# Altium schematic sheet Модуль соединений.SchDoc: Модуль соединений
size 209 x 297 mm; ApprovedBy: Кузьмич; CheckedBy: Папковский; DrawnBy: Стречень; Organization: НИЧ БГУИР; DocumentNumber: ГЛЮИ.145678.001 Э3; SheetNumber: 1; PageSetup: Record=PageOptions|CenterHorizontal=True|CenterVertical=True|PrintScale=1.00|XCorrection=1.00|YCorrection=1.00|PrintKind=2|BorderSize=5000000|LeftOffset=0|BottomOffset=0|Orientation=2|PaperLength=1000|PaperWidth=1000|Scale=100|PaperSource=7|PrintQuality=-4|MediaType=1|DitherType=10|PrintScaleMode=1|PaperKind=A4; ProcessInspection: Радевич; DocumentType: Схема электрическая принципиальная; ImagePath: ГЛЮИ.145678.001; ProjectName: Модуль
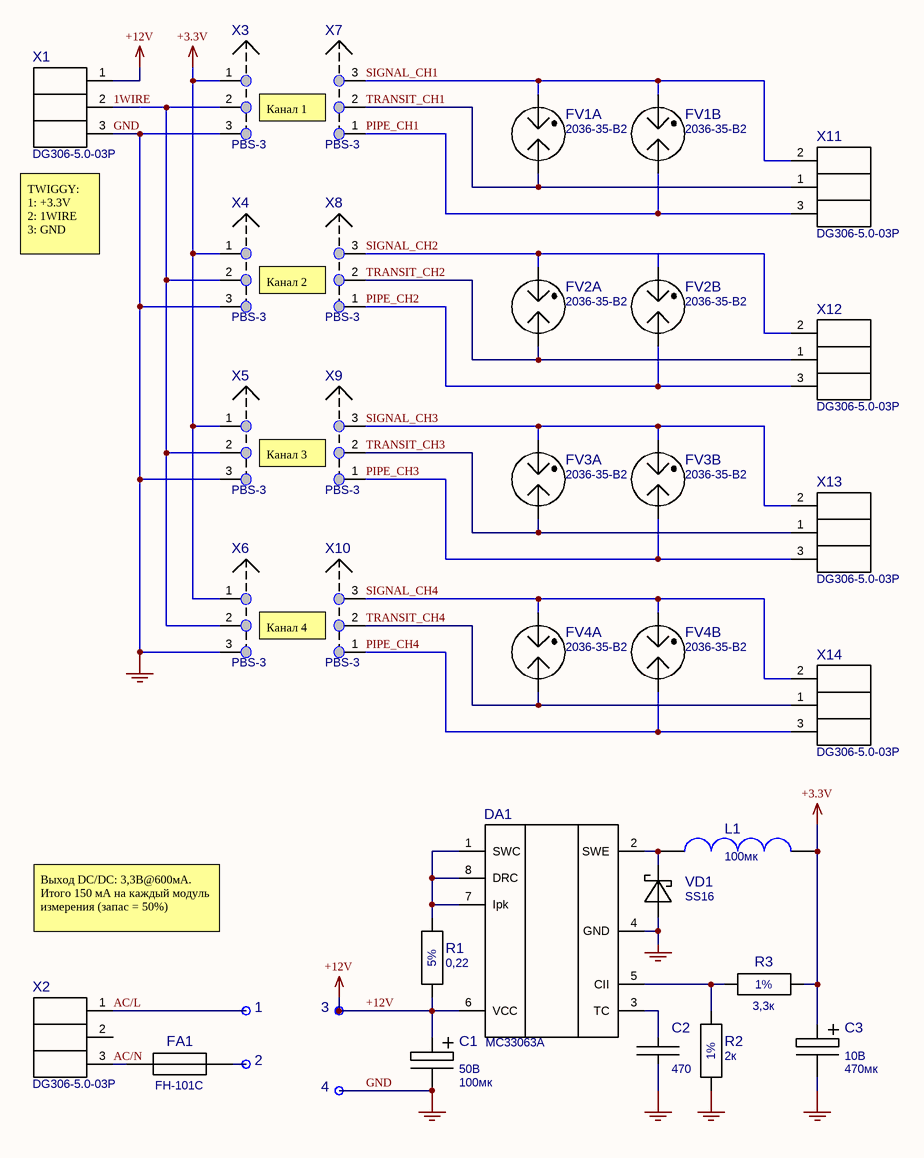
[diagram p0: Модуль соединений.SchDoc]

## Parts
1  Plated Hole  [c150h100]  (value not drawn)
2  Plated Hole  [c150h100]  (value not drawn)
3  Plated Hole  [c150h100]  (value not drawn)
4  Plated Hole  [c150h100]  (value not drawn)
C1  value 100мк  Voltage: 50В  [HITANO D08,0 H12,0 P03,5]  (hidden comment: ECR-50 В-100 мкФ±20 %)
C2  value 470  [CAPC1608L]  (hidden comment: NP0 0603-50 В-470 пФ±5 %)
C3  value 470мк  Voltage: 10В  [HITANO D08,0 H12,0 P03,5]  (hidden comment: ECR-10 В-470 мкФ±20 %)
DA1  MC33063A  [SO-08 (150MIL)]
FA1  FH-101C  [FH-101]
FV1  2036-35-B2  [2036-35-B2]  (parts A,B of 2)
FV2  2036-35-B2  [2036-35-B2]  (parts A,B of 2)
FV3  2036-35-B2  [2036-35-B2]  (parts A,B of 2)
FV4  2036-35-B2  [2036-35-B2]  (parts A,B of 2)
L1  100мк  [SDR1006]
R1  0,22  [RESC1608L]
R2  2к  [RESC1608L]
R3  3,3к  [RESC1608L]
VD1  SS16  [DO-214AC+]
X1  DG306-5.0-03P  [DG306-5.0-03P]
X2  DG306-5.0-03P  [DG306-5.0-03P]
X3  PBS-3  [PBS-3]
X4  PBS-3  [PBS-3]
X5  PBS-3  [PBS-3]
X6  PBS-3  [PBS-3]
X7  PBS-3  [PBS-3]
X8  PBS-3  [PBS-3]
X9  PBS-3  [PBS-3]
X10  PBS-3  [PBS-3]
X11  DG306-5.0-03P  [DG306-5.0-03P]
X12  DG306-5.0-03P  [DG306-5.0-03P]
X13  DG306-5.0-03P  [DG306-5.0-03P]
X14  DG306-5.0-03P  [DG306-5.0-03P]

## Nets
+3.3V: C3.1 L1.2 R3.2 X3.1 X4.1 X5.1 X6.1
+12V: 3.1 C1.1 DA1.6(VCC) R1.1 X1.1
GND: 4.1 C1.2 C2.1 C3.2 DA1.4(GND) R2.1 VD1.1 X1.3 X3.3 X4.3 X5.3 X6.3
1WIRE: X1.2 X3.2 X4.2 X5.2 X6.2
AC/L: 1.1 X2.1
AC/N: FA1.1 X2.3
PIPE_CH1: FV1.3 X7.1 X11.3
PIPE_CH2: FV2.3 X8.1 X12.3
PIPE_CH3: FV3.3 X9.1 X13.3
PIPE_CH4: FV4.3 X10.1 X14.3
SIGNAL_CH1: FV1.2 X7.3 X11.2
SIGNAL_CH2: FV2.2 X8.3 X12.2
SIGNAL_CH3: FV3.2 X9.3 X13.2
SIGNAL_CH4: FV4.2 X10.3 X14.2
TRANSIT_CH1: FV1.1 X7.2 X11.1
TRANSIT_CH2: FV2.1 X8.2 X12.1
TRANSIT_CH3: FV3.1 X9.2 X13.1
TRANSIT_CH4: FV4.1 X10.2 X14.1
Net2_1: 2.1 FA1.2
NetC2_2: C2.2 DA1.3(TC)
NetDA1_1: DA1.1(SWC) DA1.7(Ipk) DA1.8(DRC) R1.2
NetDA1_2: DA1.2(SWE) L1.1 VD1.2
NetDA1_5: DA1.5(CII) R2.2 R3.1

Not connected (* = marked no-connect by the designer): X2 2

## Notes on the sheet
- Канал 1
- (near X1) TWIGGY:
  1: +3.3V
  2: 1WIRE
  3: GND
- Канал 2
- Канал 3
- Канал 4
- Выход DC/DC: 3,3В@600мА.
  Итого 150 мА на каждый модуль измерения (запас = 50%)
- Перв. примен.
- Справ. №
- Подп. и дата
- Инв. № дубл.
- Взам. инв. №
- Изм.
- Лист
- № докум.
- Подп.
- Дата
- Лит.
- Масса
- Масштаб
- Т.контр.
- Пров.
- Разраб.
- Листов
- Инв. № подл.
- Согл.
- Н.контр.
- Утв.
- Копировал
- Формат А4
- (in symbol 0603 0,22 Ом±5 %) 5%
- (in symbol 0603 10 кОм±1 %) 1%
- (in symbol 0603 16 кОм±1 %) 1%

## Library data of the parts
1-4 = PLATED_HOLE1.0_PAD1.5: Single Terminal Socket; Part Description: Plated Through Hole: Hole Dia.=1.0mm Pad Dia.=1.5mm; Mounted: No; Table: Pads; Part Number: PLATED_HOLE1.0_PAD1.5; Component Kind: Standard (No BOM); Component Type: Standard (No BOM); Pin Count: 1; Family: Plated Hole; Socket: No; SMD: No; Status: None; ComponentHeight: 0mm; Author: CERN DEM JLC; CreateDate: 30.10.2008; LatestRevisionDate: 30.10.2008; PackageDescription: Plated Through Hole: Hole Dia.=1mm Pad Dia.=1.5mm
C2 = NP0 0603-50 В-470 пФ±5 %: Type: Конденсатор; Price: 0,03
FA1 = FH-101C: FH-101; Value: FH-101C
FV1-FV4 = 2036-35-B2: Current - AC Discharge (Nom): 10A; Impulse Discharge Current (8/20µs): 10kA; Supplier 1: Digi-Key; Supplier Part Number 1: 2036-35-B2LF-ND; ComponentLink1URL: http://www.bourns.com/data/global/PDFs/2036.pdf; ComponentLink1Description: http://www.bourns.com/data/global/PDFs/2036.pdf; Price: 1=2.17, 10=1.967, 25=1.8632, 50=1.587, 100=1.3455, 250=1.311, 500=1.104, 1000=0.98325, 2500=0.9315 (USD)
L1 = SDR1006-101KL 100 мкГн: Manufacturer: Bourns Inc.; Current Rating: 970mA; Shielding: Unshielded; Inductance: 100µH; Frequency - Self Resonant: 5.2MHz; Current - Saturation: 1.7A; Tolerance: ±10%; Value: 100мк; Supplier 1: Digi-Key; Supplier Part Number 1: SDR1006-101KLDKR-ND; Operating Temperature: -40°C ~ 125°C; Manufacturer Part Number: SDR1006-101KL; Supplier: Digi-Key; Category: Inductors, Coils, Chokes; RoHS: RoHS Compliant; Height - Seated (Max): 0.228" (5.80mm); Size / Dimension: 0.386" L x 0.386" W (9.80mm x 9.80mm); Supplier Part Number: SDR1006-101KLDKR-ND
R1 = 0603 0,22 Ом±5 %: Value: 0,22
R2 = 0603 10 кОм±1 %: Value: 2к
R3 = 0603 16 кОм±1 %: Value: 3,3к
VD1 = SS16: Type: Диод; Value: SS16
DA1 = MC33063A: Value: MC33063A
X1 X2 X11-X14 = DG306-5.0-03P: Value: DG306-5.0-03P